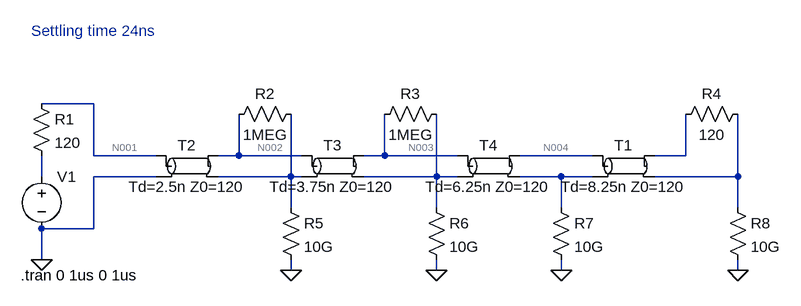
[diagram p0: schematic bestCase.asc]
bestCase.asc, the LTspice schematic file:
Version 4
SHEET 1 1060 680
WIRE -48 16 -128 16
WIRE -48 96 -48 16
WIRE 48 96 -48 96
WIRE 176 96 176 32
WIRE 176 96 144 96
WIRE 272 96 176 96
WIRE 400 96 400 32
WIRE 400 96 368 96
WIRE 512 96 400 96
WIRE 720 96 608 96
WIRE 864 96 864 32
WIRE 864 96 816 96
WIRE -128 128 -128 96
WIRE 48 128 -48 128
WIRE 256 128 256 32
WIRE 256 128 144 128
WIRE 272 128 256 128
WIRE 480 128 480 32
WIRE 480 128 368 128
WIRE 512 128 480 128
WIRE 672 128 608 128
WIRE 720 128 672 128
WIRE 944 128 944 32
WIRE 944 128 816 128
WIRE 256 176 256 128
WIRE 480 176 480 128
WIRE 672 176 672 128
WIRE 944 176 944 128
WIRE -48 208 -48 128
WIRE -48 208 -128 208
WIRE -128 256 -128 208
WIRE 256 272 256 256
WIRE 480 272 480 256
WIRE 672 272 672 256
WIRE 944 272 944 256
FLAG -128 256 0
FLAG 256 272 0
FLAG 480 272 0
FLAG 672 272 0
FLAG 944 272 0
SYMBOL tline 96 112 R0
SYMATTR InstName T2
SYMATTR Value Td=2.5n Z0=120
SYMBOL tline 320 112 R0
SYMATTR InstName T3
SYMATTR Value Td=3.75n Z0=120
SYMBOL tline 560 112 R0
SYMATTR InstName T4
SYMATTR Value Td=6.25n Z0=120
SYMBOL voltage -128 112 R0
WINDOW 3 377 96 Invisible 2
WINDOW 123 0 0 Left 2
WINDOW 39 0 0 Left 2
SYMATTR Value PULSE(0 4 0 0 0 80000 80000 1)
SYMATTR InstName V1
SYMBOL res -144 0 R0
SYMATTR InstName R1
SYMATTR Value 120
SYMBOL res 496 16 R90
WINDOW 0 0 56 VBottom 2
WINDOW 3 32 56 VTop 2
SYMATTR InstName R3
SYMATTR Value 1MEG
SYMBOL res 272 16 R90
WINDOW 0 0 56 VBottom 2
WINDOW 3 32 56 VTop 2
SYMATTR InstName R2
SYMATTR Value 1MEG
SYMBOL tline 768 112 R0
SYMATTR InstName T1
SYMATTR Value Td=8.25n Z0=120
SYMBOL res 848 48 R270
WINDOW 0 32 56 VTop 2
WINDOW 3 0 56 VBottom 2
SYMATTR InstName R4
SYMATTR Value 120
SYMBOL res 240 160 R0
SYMATTR InstName R5
SYMATTR Value 10G
SYMBOL res 464 160 R0
SYMATTR InstName R6
SYMATTR Value 10G
SYMBOL res 656 160 R0
SYMATTR InstName R7
SYMATTR Value 10G
SYMBOL res 928 160 R0
SYMATTR InstName R8
SYMATTR Value 10G
TEXT -160 280 Left 2 !.tran 0 1us 0 1us
TEXT -144 -96 Left 2 ;Settling time 24ns

The netlist it stands for:
* bestCase.asc
T2 N001 0 N002 N007 Td=2.5n Z0=120
T3 N002 N007 N003 N008 Td=3.75n Z0=120
T4 N003 N008 N004 N009 Td=6.25n Z0=120
V1 N006 0 PULSE(0 4 0 0 0 80000 80000 1)
R1 N001 N006 120
R3 N008 N003 1MEG
R2 N007 N002 1MEG
T1 N004 N009 N005 N010 Td=8.25n Z0=120
R4 N005 N010 120
R5 N007 0 10G
R6 N008 0 10G
R7 N009 0 10G
R8 N010 0 10G
.tran 0 1us 0 1us
* Settling time 24ns
.backanno
.end

* Results of the author's LTspice run, read from the files saved beside the schematic
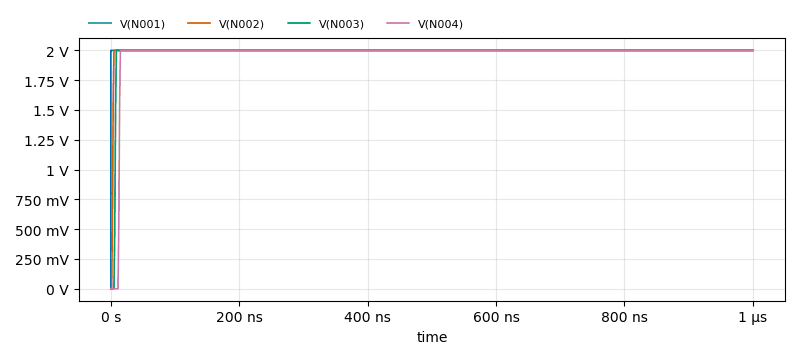
[diagram p1: Transient Analysis of bestCase.asc, plotted from the saved traces]
* Transient Analysis, 1 run:
*   V(N001): min 0 V, max 2 V, average 2 V, rms 2 V, last 2 V
*   V(N002): min 0 V, max 2 V, average 1.994 V, rms 1.996 V, last 2 V
*   V(N003): min 0 V, max 2 V, average 1.986 V, rms 1.993 V, last 2 V
*   V(N004): min 0 V, max 2 V, average 1.974 V, rms 1.986 V, last 2 V